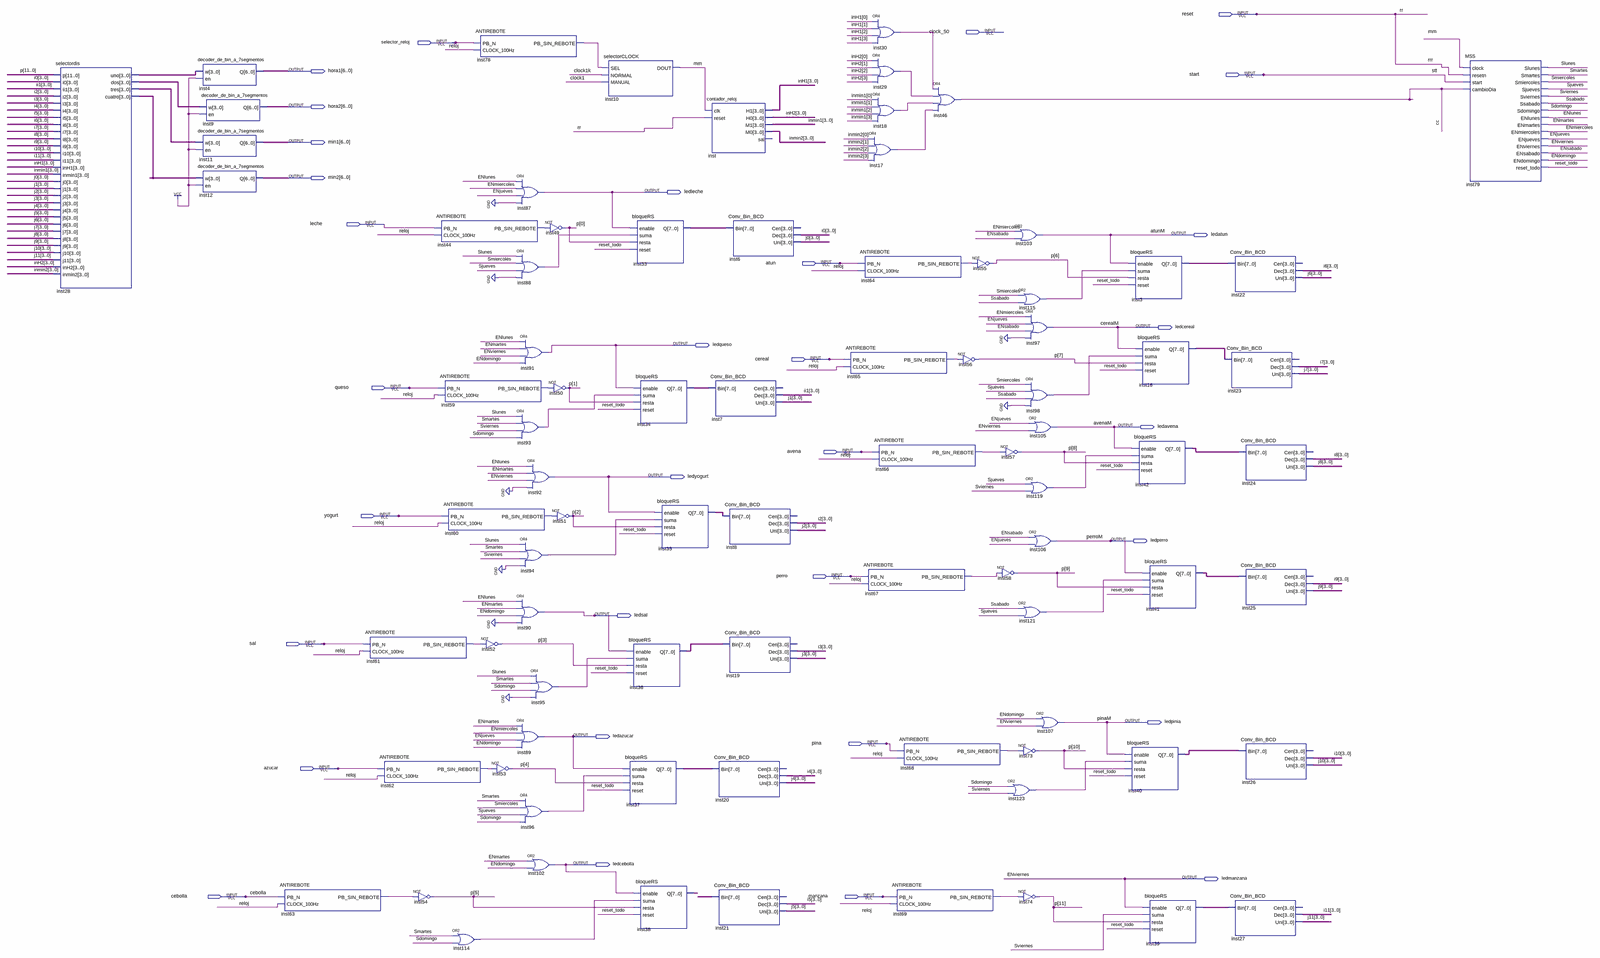
[diagram p0: schematic sheet, whole]
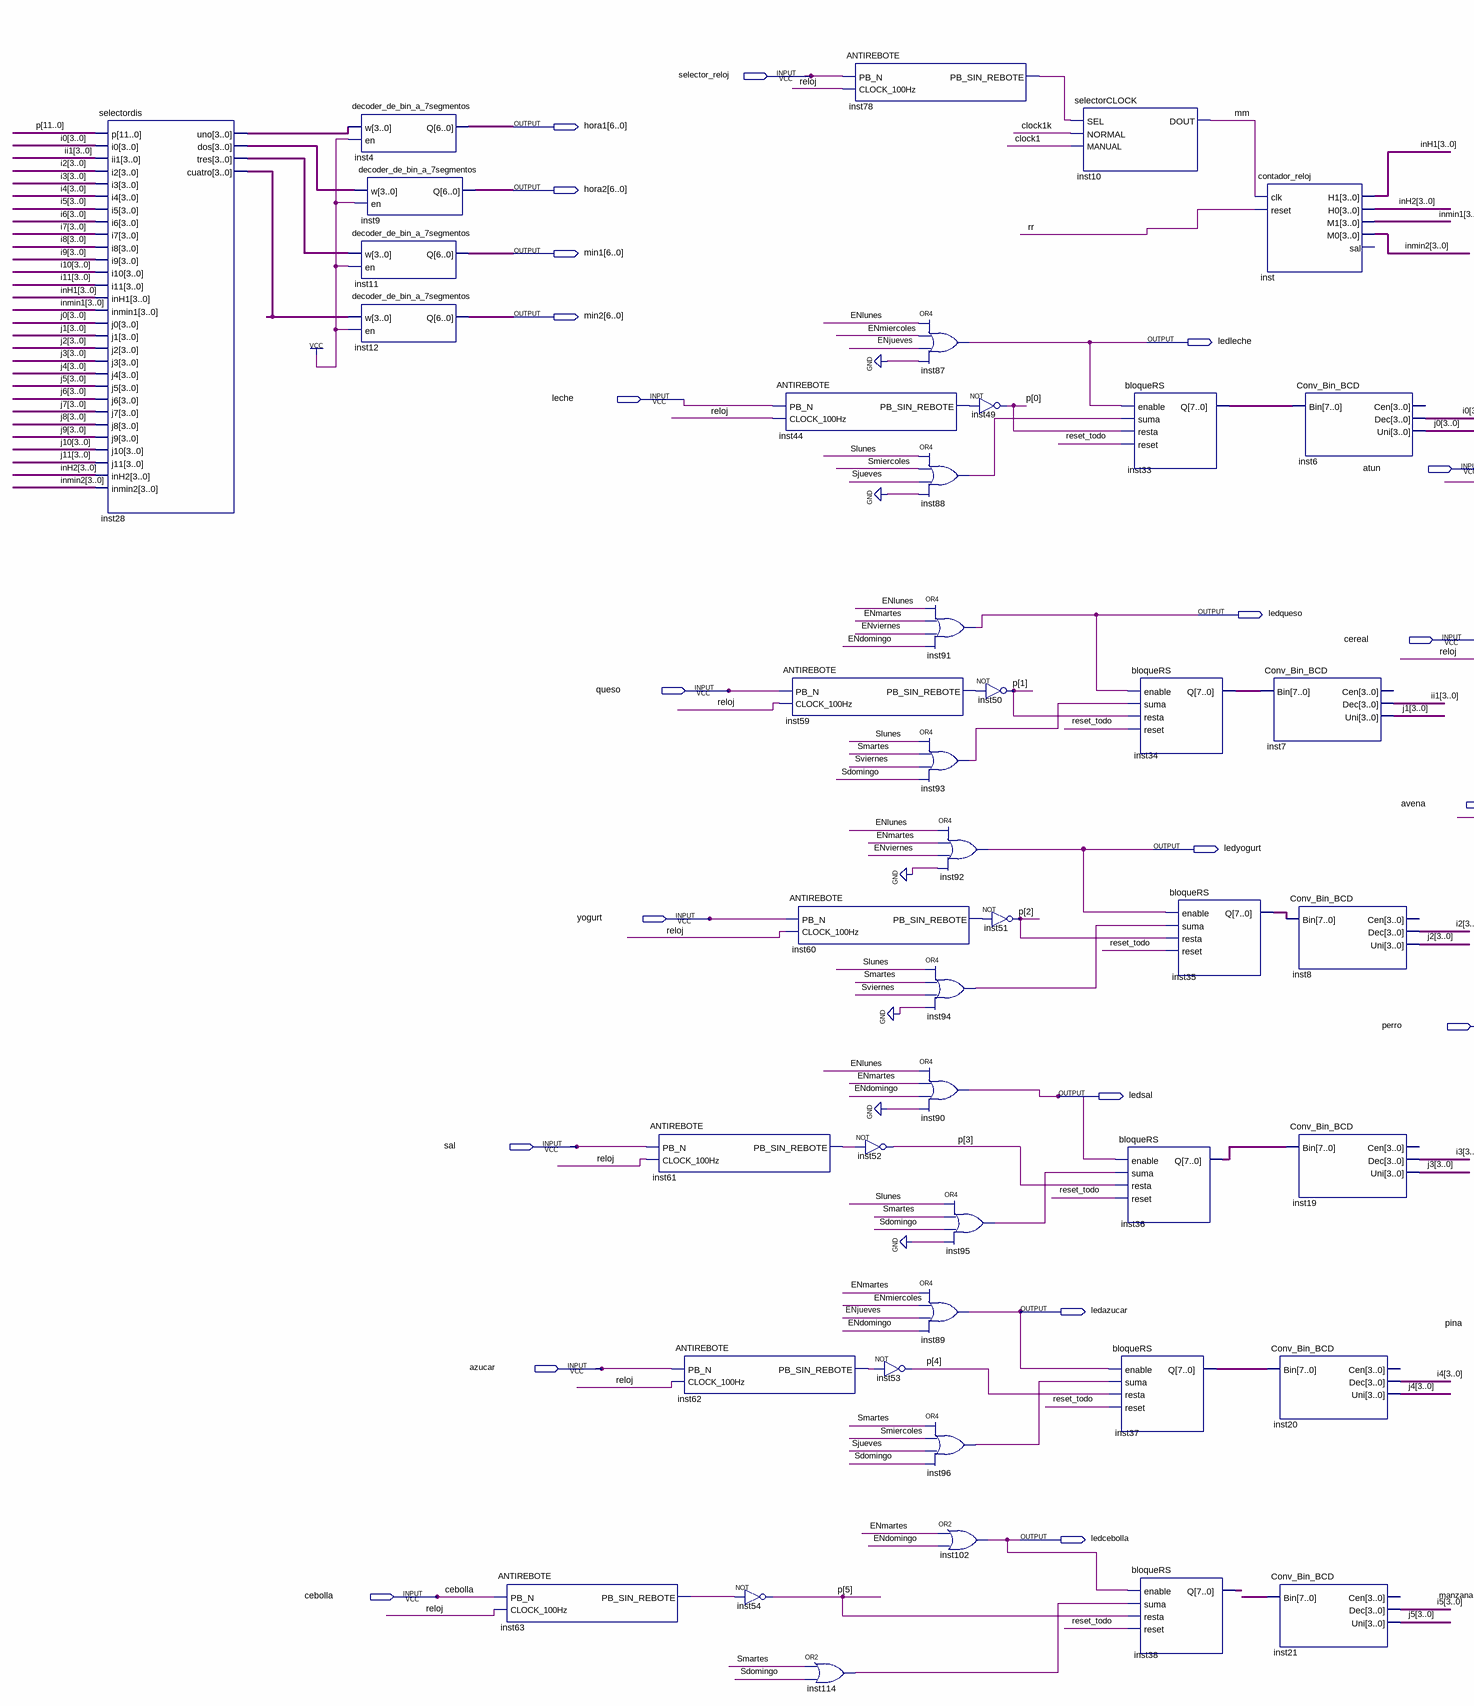
[diagram p1: schematic sheet, left part]
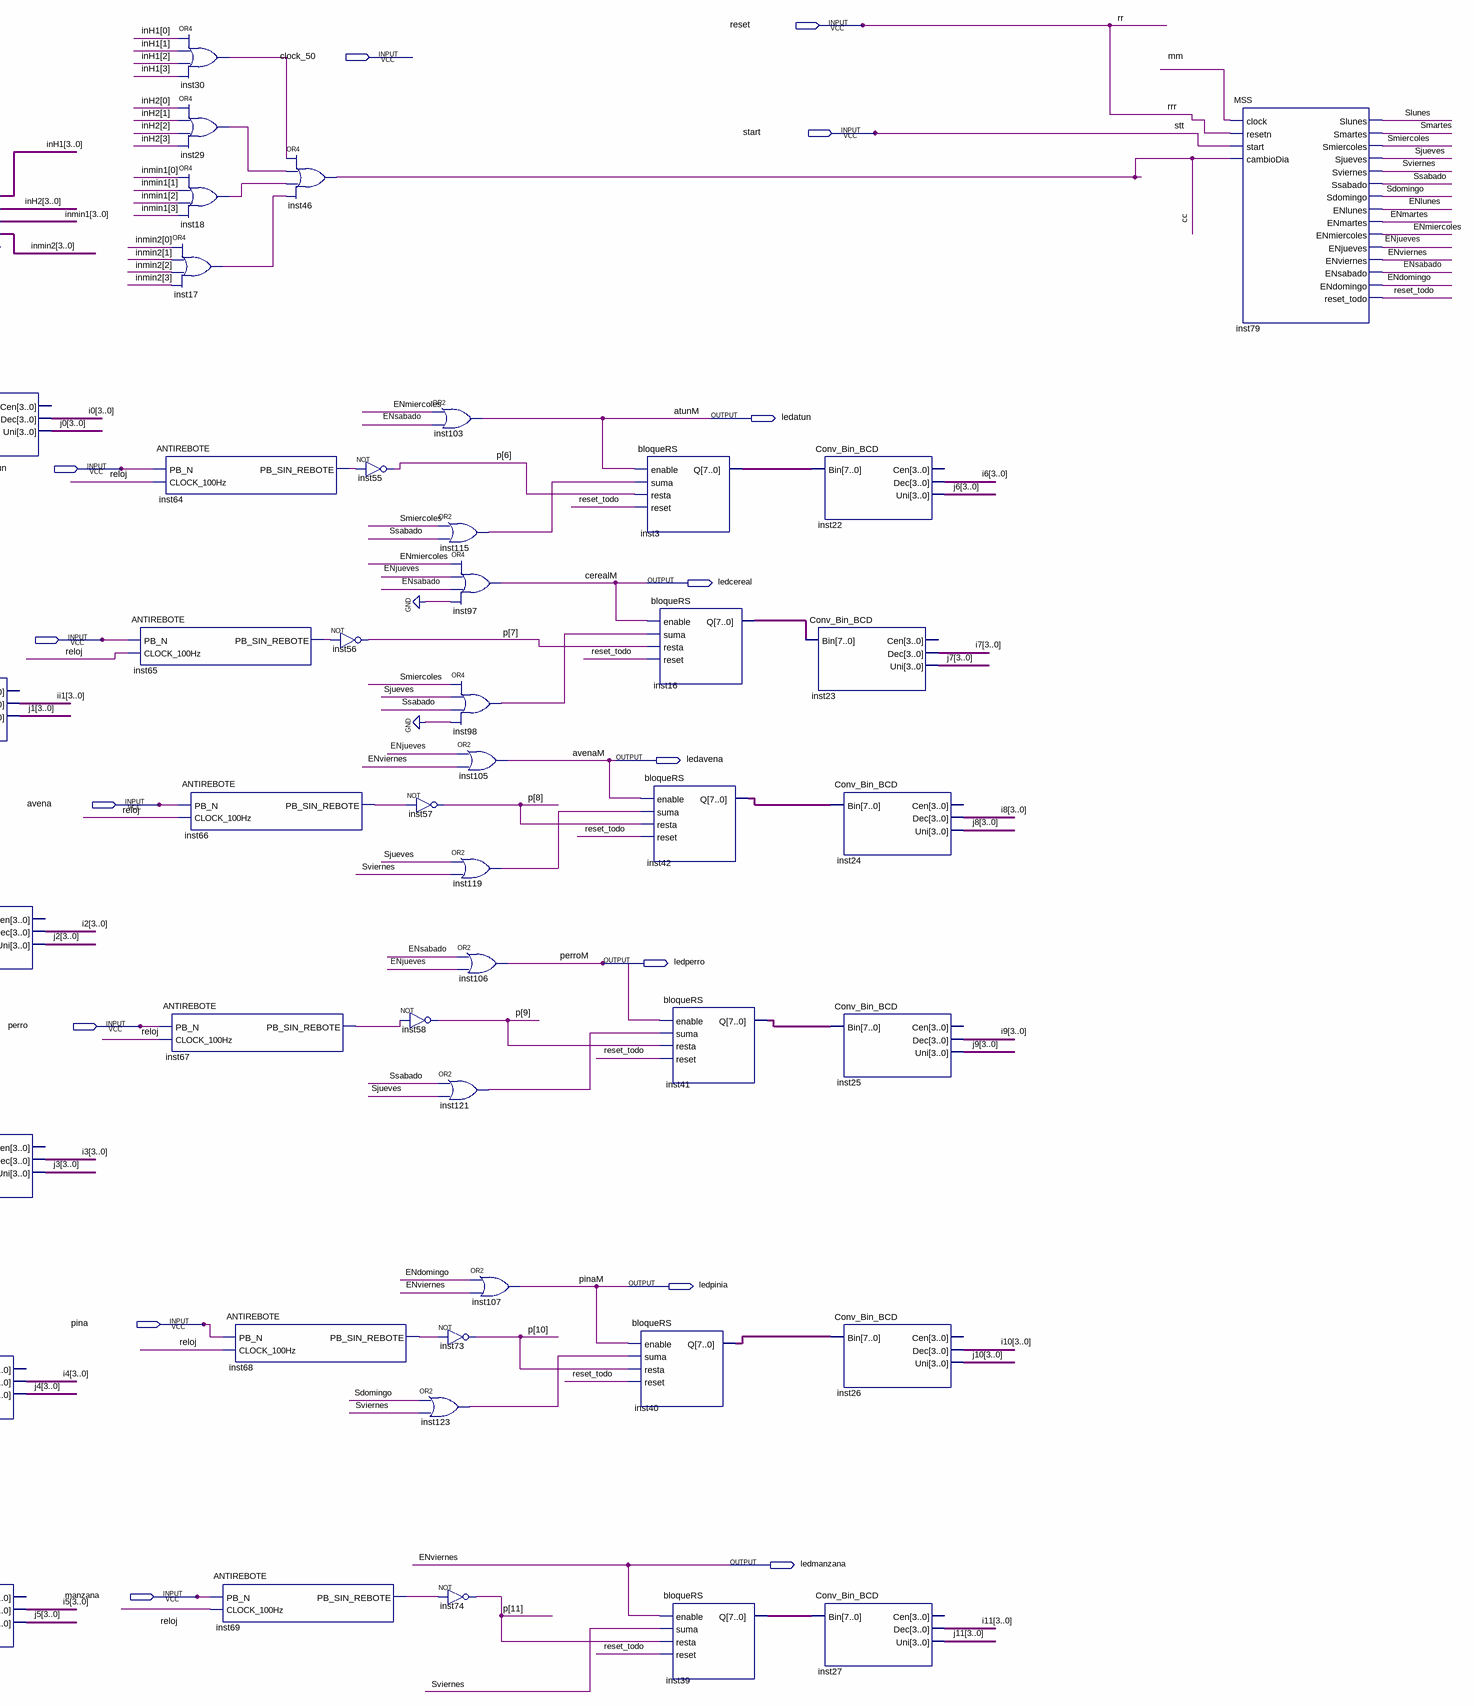
[diagram p2: schematic sheet, right part]
// Quartus schematic circuito.bdf as structural Verilog: 84 symbols, 32 pins
module circuito (
  input  reset,
  input  clock_50,
  input  selector_reloj,
  input  start,
  input  leche,
  input  atun,
  input  cereal,
  input  queso,
  input  avena,
  input  yogurt,
  input  perro,
  input  sal,
  input  pina,
  input  azucar,
  input  cebolla,
  input  manzana,
  output [6:0] hora1,
  output [6:0] hora2,
  output [6:0] min1,
  output [6:0] min2,
  output ledleche,
  output ledatun,
  output ledcereal,
  output ledqueso,
  output ledavena,
  output ledyogurt,
  output ledperro,
  output ledsal,
  output ledpinia,
  output ledazucar,
  output ledcebolla,
  output ledmanzana
);

  wire cc, clock1, clock1k, ENdomingo, ENjueves, ENlunes, ENmartes, ENmiercoles, ENsabado, inst17_out,
       inst18_out, inst29_out, inst30_out, inst44_pb_sin_rebote, inst59_pb_sin_rebote, inst60_pb_sin_rebote,
       inst61_pb_sin_rebote, inst62_pb_sin_rebote, inst63_pb_sin_rebote, inst64_pb_sin_rebote,
       inst65_pb_sin_rebote, inst66_pb_sin_rebote, inst67_pb_sin_rebote, inst68_pb_sin_rebote,
       inst69_pb_sin_rebote, inst78_pb_sin_rebote, inst88_out, inst93_out, inst94_out, inst95_out,
       inst96_out, inst98_out, inst114_out, inst115_out, inst119_out, inst121_out, inst123_out, mm, reloj,
       reset_todo, Sdomingo, Sjueves, Slunes, Smartes, Smiercoles, Ssabado, Sviernes;
  wire [3:0] i0, i2, i3, i4, i5, i6, i7, i8, i9, i10, i11, ii1, inH1, inH2, inmin1, inmin2, inst28_cuatro,
       inst28_dos, inst28_tres, inst28_uno, j0, j1, j2, j3, j4, j5, j6, j7, j8, j9, j10, j11;
  wire [7:0] inst3_q, inst16_q, inst33_q, inst34_q, inst35_q, inst36_q, inst37_q, inst38_q, inst39_q,
       inst40_q, inst41_q, inst42_q, undriven;
  wire [11:0] p;

  selectordis inst28 (
    .p(p), .i0(i0), .ii1(ii1), .i2(i2), .i3(i3), .i4(i4), .i5(i5), .i6(i6), .i7(i7), .i8(i8), .i9(i9),
    .i10(i10), .i11(i11), .inH1(inH1), .inmin1(inmin1), .j0(j0), .j1(j1), .j2(j2), .j3(j3), .j4(j4), .j5(j5),
    .j6(j6), .j7(j7), .j8(j8), .j9(j9), .j10(j10), .j11(j11), .inH2(inH2), .inmin2(inmin2), .uno(inst28_uno),
    .dos(inst28_dos), .tres(inst28_tres), .cuatro(inst28_cuatro));
  decoder_de_bin_a_7segmentos inst4 (.w(inst28_uno), .en(1'b1), .Q(hora1));
  decoder_de_bin_a_7segmentos inst9 (.w(inst28_dos), .en(1'b1), .Q(hora2));
  decoder_de_bin_a_7segmentos inst11 (.w(inst28_tres), .en(1'b1), .Q(min1));
  decoder_de_bin_a_7segmentos inst12 (.w(inst28_cuatro), .en(1'b1), .Q(min2));
  ANTIREBOTE inst63 (.PB_N(cebolla), .CLOCK_100Hz(reloj), .PB_SIN_REBOTE(inst63_pb_sin_rebote));
  ANTIREBOTE inst61 (.PB_N(sal), .CLOCK_100Hz(reloj), .PB_SIN_REBOTE(inst61_pb_sin_rebote));
  ANTIREBOTE inst62 (.PB_N(azucar), .CLOCK_100Hz(reloj), .PB_SIN_REBOTE(inst62_pb_sin_rebote));
  not inst54 (p[5], inst63_pb_sin_rebote);
  ANTIREBOTE inst44 (.PB_N(leche), .CLOCK_100Hz(reloj), .PB_SIN_REBOTE(inst44_pb_sin_rebote));
  ANTIREBOTE inst59 (.PB_N(queso), .CLOCK_100Hz(reloj), .PB_SIN_REBOTE(inst59_pb_sin_rebote));
  ANTIREBOTE inst60 (.PB_N(yogurt), .CLOCK_100Hz(reloj), .PB_SIN_REBOTE(inst60_pb_sin_rebote));
  ANTIREBOTE inst78 (.PB_N(selector_reloj), .CLOCK_100Hz(reloj), .PB_SIN_REBOTE(inst78_pb_sin_rebote));
  or inst114 (inst114_out, Smartes, Sdomingo);
  not inst52 (p[3], inst61_pb_sin_rebote);
  not inst53 (p[4], inst62_pb_sin_rebote);
  or inst87 (ledleche, ENlunes, ENmiercoles, ENjueves, 1'b0);
  or inst88 (inst88_out, Slunes, Smiercoles, Sjueves, 1'b0);
  or inst91 (ledqueso, ENlunes, ENmartes, ledmanzana, ENdomingo);
  or inst93 (inst93_out, Slunes, Smartes, Sviernes, Sdomingo);
  or inst92 (ledyogurt, ENlunes, ENmartes, ledmanzana, 1'b0);
  or inst94 (inst94_out, Slunes, Smartes, Sviernes, 1'b0);
  or inst90 (ledsal, ENlunes, ENmartes, ENdomingo, 1'b0);
  or inst95 (inst95_out, Slunes, Smartes, Sdomingo, 1'b0);
  or inst89 (ledazucar, ENmartes, ENmiercoles, ENjueves, ENdomingo);
  or inst96 (inst96_out, Smartes, Smiercoles, Sjueves, Sdomingo);
  or inst102 (ledcebolla, ENmartes, ENdomingo);
  not inst49 (p[0], inst44_pb_sin_rebote);
  not inst50 (p[1], inst59_pb_sin_rebote);
  not inst51 (p[2], inst60_pb_sin_rebote);
  selectorCLOCK inst10 (.SEL(inst78_pb_sin_rebote), .NORMAL(clock1k), .MANUAL(clock1), .DOUT(mm));
  bloqueRS inst33 (.enable(ledleche), .suma(inst88_out), .resta(p[0]), .reset(reset_todo), .Q(inst33_q));
  bloqueRS inst34 (.enable(ledqueso), .suma(inst93_out), .resta(p[1]), .reset(reset_todo), .Q(inst34_q));
  bloqueRS inst36 (.enable(ledsal), .suma(inst95_out), .resta(p[3]), .reset(reset_todo), .Q(inst36_q));
  bloqueRS inst37 (.enable(ledazucar), .suma(inst96_out), .resta(p[4]), .reset(reset_todo), .Q(inst37_q));
  bloqueRS inst38 (.enable(ledcebolla), .suma(inst114_out), .resta(p[5]), .reset(reset_todo), .Q(inst38_q));
  bloqueRS inst35 (.enable(ledyogurt), .suma(inst94_out), .resta(p[2]), .reset(reset_todo), .Q(inst35_q));
  contador_reloj inst (.clk(mm), .reset(reset), .H1(inH1), .H0(inH2), .M1(inmin1), .M0(inmin2));  // open: sal
  Conv_Bin_BCD inst6 (.Bin(inst33_q), .Dec(i0), .Uni(j0));  // open: Cen
  Conv_Bin_BCD inst7 (.Bin(inst34_q), .Dec(ii1), .Uni(j1));  // open: Cen
  Conv_Bin_BCD inst8 (.Bin(inst35_q), .Dec(i2), .Uni(j2));  // open: Cen
  Conv_Bin_BCD inst19 (.Bin(inst36_q), .Dec(i3), .Uni(j3));  // open: Cen
  Conv_Bin_BCD inst20 (.Bin(inst37_q), .Dec(i4), .Uni(j4));  // open: Cen
  Conv_Bin_BCD inst21 (.Bin(undriven), .Dec(i5), .Uni(j5));  // open: Cen
  ANTIREBOTE inst65 (.PB_N(cereal), .CLOCK_100Hz(reloj), .PB_SIN_REBOTE(inst65_pb_sin_rebote));
  or inst30 (inst30_out, inH1[0], inH1[1], inH1[2], inH1[3]);
  or inst29 (inst29_out, inH2[0], inH2[1], inH2[2], inH2[3]);
  or inst18 (inst18_out, inmin1[0], inmin1[1], inmin1[2], inmin1[3]);
  or inst17 (inst17_out, inmin2[0], inmin2[1], inmin2[2], inmin2[3]);
  ANTIREBOTE inst64 (.PB_N(atun), .CLOCK_100Hz(reloj), .PB_SIN_REBOTE(inst64_pb_sin_rebote));
  ANTIREBOTE inst66 (.PB_N(avena), .CLOCK_100Hz(reloj), .PB_SIN_REBOTE(inst66_pb_sin_rebote));
  ANTIREBOTE inst67 (.PB_N(perro), .CLOCK_100Hz(reloj), .PB_SIN_REBOTE(inst67_pb_sin_rebote));
  ANTIREBOTE inst68 (.PB_N(pina), .CLOCK_100Hz(reloj), .PB_SIN_REBOTE(inst68_pb_sin_rebote));
  ANTIREBOTE inst69 (.PB_N(manzana), .CLOCK_100Hz(reloj), .PB_SIN_REBOTE(inst69_pb_sin_rebote));
  or inst46 (cc, inst30_out, inst29_out, inst18_out, inst17_out);
  not inst56 (p[7], inst65_pb_sin_rebote);
  not inst55 (p[6], inst64_pb_sin_rebote);
  or inst103 (ledatun, ENmiercoles, ENsabado);
  not inst57 (p[8], inst66_pb_sin_rebote);
  not inst58 (p[9], inst67_pb_sin_rebote);
  or inst123 (inst123_out, Sdomingo, Sviernes);
  or inst115 (inst115_out, Smiercoles, Ssabado);
  or inst97 (ledcereal, ENmiercoles, ENjueves, ENsabado, 1'b0);
  or inst98 (inst98_out, Smiercoles, Sjueves, Ssabado, 1'b0);
  or inst105 (ledavena, ENjueves, ledmanzana);
  or inst119 (inst119_out, Sjueves, Sviernes);
  or inst106 (ledperro, ENsabado, ENjueves);
  or inst121 (inst121_out, Ssabado, Sjueves);
  or inst107 (ledpinia, ENdomingo, ledmanzana);
  not inst73 (p[10], inst68_pb_sin_rebote);
  not inst74 (p[11], inst69_pb_sin_rebote);
  bloqueRS inst3 (.enable(ledatun), .suma(inst115_out), .resta(p[6]), .reset(reset_todo), .Q(inst3_q));
  bloqueRS inst40 (.enable(ledpinia), .suma(inst123_out), .resta(p[10]), .reset(reset_todo), .Q(inst40_q));
  bloqueRS inst16 (.enable(ledcereal), .suma(inst98_out), .resta(p[7]), .reset(reset_todo), .Q(inst16_q));
  bloqueRS inst42 (.enable(ledavena), .suma(inst119_out), .resta(p[8]), .reset(reset_todo), .Q(inst42_q));
  bloqueRS inst41 (.enable(ledperro), .suma(inst121_out), .resta(p[9]), .reset(reset_todo), .Q(inst41_q));
  bloqueRS inst39 (.enable(ledmanzana), .suma(Sviernes), .resta(p[11]), .reset(reset_todo), .Q(inst39_q));
  Conv_Bin_BCD inst22 (.Bin(inst3_q), .Dec(i6), .Uni(j6));  // open: Cen
  Conv_Bin_BCD inst23 (.Bin(inst16_q), .Dec(i7), .Uni(j7));  // open: Cen
  Conv_Bin_BCD inst24 (.Bin(inst42_q), .Dec(i8), .Uni(j8));  // open: Cen
  Conv_Bin_BCD inst25 (.Bin(inst41_q), .Dec(i9), .Uni(j9));  // open: Cen
  Conv_Bin_BCD inst26 (.Bin(inst40_q), .Dec(i10), .Uni(j10));  // open: Cen
  Conv_Bin_BCD inst27 (.Bin(inst39_q), .Dec(i11), .Uni(j11));  // open: Cen
  MSS inst79 (
    .clock(mm), .resetn(reset), .start(start), .cambioDia(cc), .Slunes(Slunes), .Smartes(Smartes),
    .Smiercoles(Smiercoles), .Sjueves(Sjueves), .Sviernes(Sviernes), .Ssabado(Ssabado), .Sdomingo(Sdomingo),
    .ENlunes(ENlunes), .ENmartes(ENmartes), .ENmiercoles(ENmiercoles), .ENjueves(ENjueves),
    .ENviernes(ledmanzana), .ENsabado(ENsabado), .ENdomingo(ENdomingo), .reset_todo(reset_todo));

  // Other names for the same wires on the sheet: atunM = ledatun; cerealM = ledcereal; ENviernes = ledmanzana;
  //   avenaM = ledavena; perroM = ledperro; pinaM = ledpinia; rr = reset; rrr = reset; stt = start
endmodule
